# EAGLE design h_bridge (EAGLE 6.1)
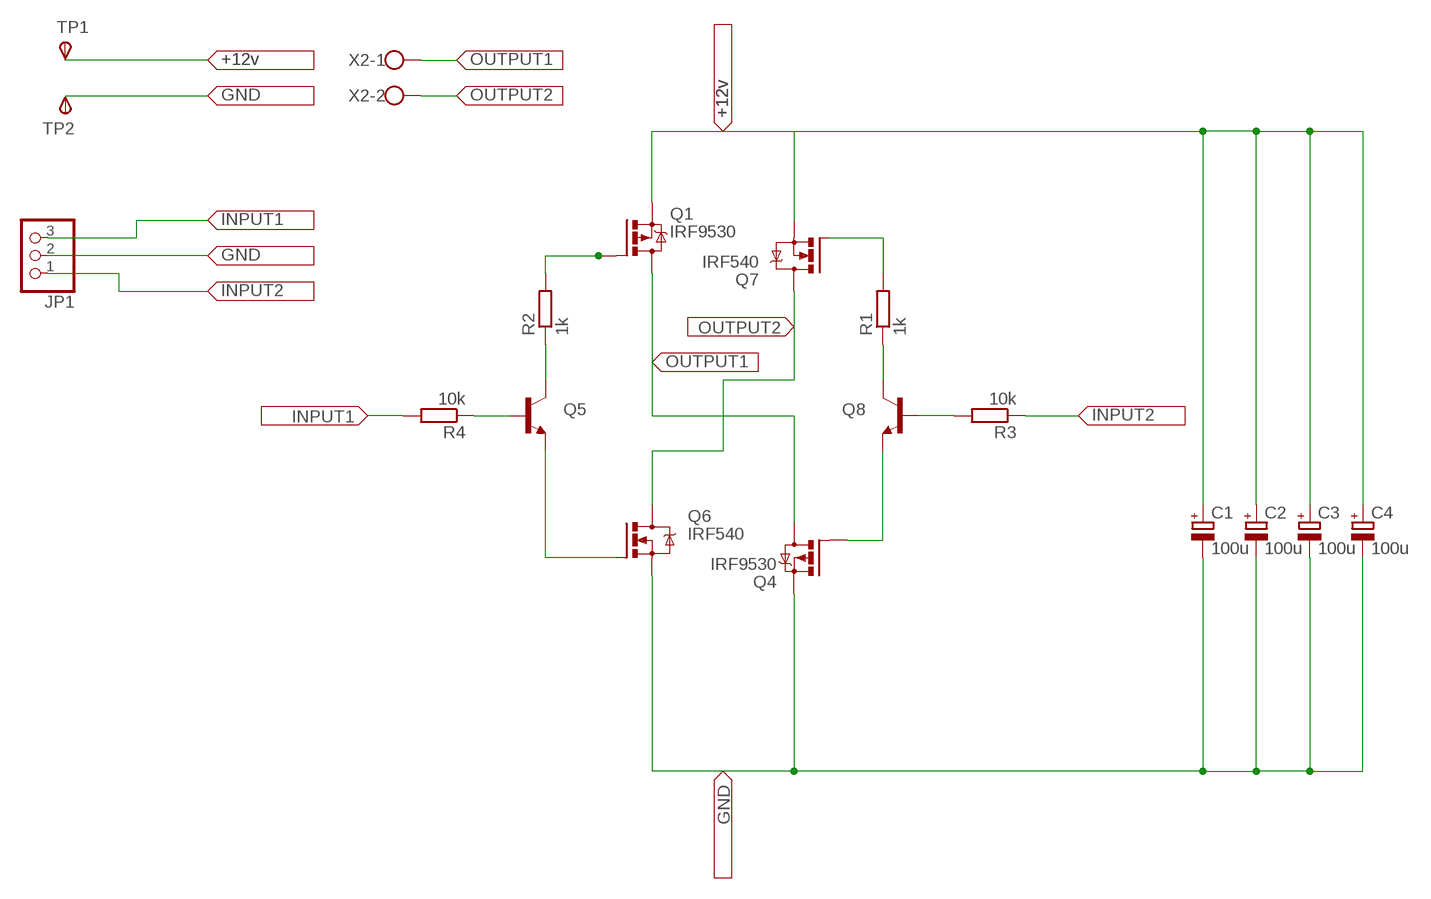
[diagram p0: schematic, sheet 1]

## Parts
C1  100u  CPOL-EUE2,5-6E  [E2,5-6E]
C2  100u  CPOL-EUE2,5-6E  [E2,5-6E]
C3  100u  CPOL-EUE2,5-6E  [E2,5-6E]
C4  100u  CPOL-EUE2,5-6E  [E2,5-6E]
JP1  PINHD-1X3  [1X03]
Q1  IRF9530  [TO220BV]
Q4  IRF9530  [TO220BV]
Q5  TRANSISTOR_NPNTO92  [TO-92]
Q6  IRF540  [TO220BV]
Q7  IRF540  [TO220BV]
Q8  TRANSISTOR_NPNTO92  [TO-92]
R1  1k  R-EU_0207/7  [0207/7]
R2  1k  R-EU_0207/7  [0207/7]
R3  10k  R-EU_0207/7  [0207/7]
R4  10k  R-EU_0207/7  [0207/7]
TP1  TPSPAD1-17Y  [P1-17Y]
TP2  TPSPAD1-17Y  [P1-17Y]
X2  W237-02P  [W237-132]

## Nets
+12V: C1.+ C2.+ C3.+ C4.+ Q1.S Q7.S TP1.TP(PP)
GND: C1.- C2.- C3.- C4.- JP1.2 Q4.S Q6.S TP2.TP(PP)
INPUT1: JP1.3 R4.2
INPUT2: JP1.1 R3.1
N$1: Q5.3(C) R2.1
N$2: Q1.G R2.2
N$3: R1.2
N$4: Q8.3(C) R1.1
N$5: Q5.1(E)
N$6: Q4.G Q8.1(E)
N$7: Q5.2(B) R4.1
N$8: Q8.2(B) R3.2
OUTPUT1: Q1.D Q4.D X2.1
OUTPUT2: Q6.D Q7.D X2.2
Unconnected: Q6.G Q7.G

## Library data of the parts
C1-C4 = resistor:CPOL-EU: POLARIZED CAPACITOR, European symbol
JP1 = pinhead:PINHD-1X3: PIN HEADER
Q1 Q4 = transistor-power:IRF9530: P-CHANNEL HEXFET POWER-MOS-FET Source: http://www.irf.com/product-info/datasheets/data/irf9530.pdf
Q5 Q8 = SparkFun:TRANSISTOR_NPN: Transistor NPN BJT configuration in SOT23 package. MMBT2222 is the common NPN we use. Double check BCE configuration again layout.
Q6 Q7 = transistor-power:IRF540: HEXFET Power MOSFET
R1-R4 = resistor:R-EU_: RESISTOR, European symbol
TP1 TP2 = testpad:TPS: TEST PIN
X2 = con-wago-508:W237-02P: WAGO SREW CLAMP

## Board
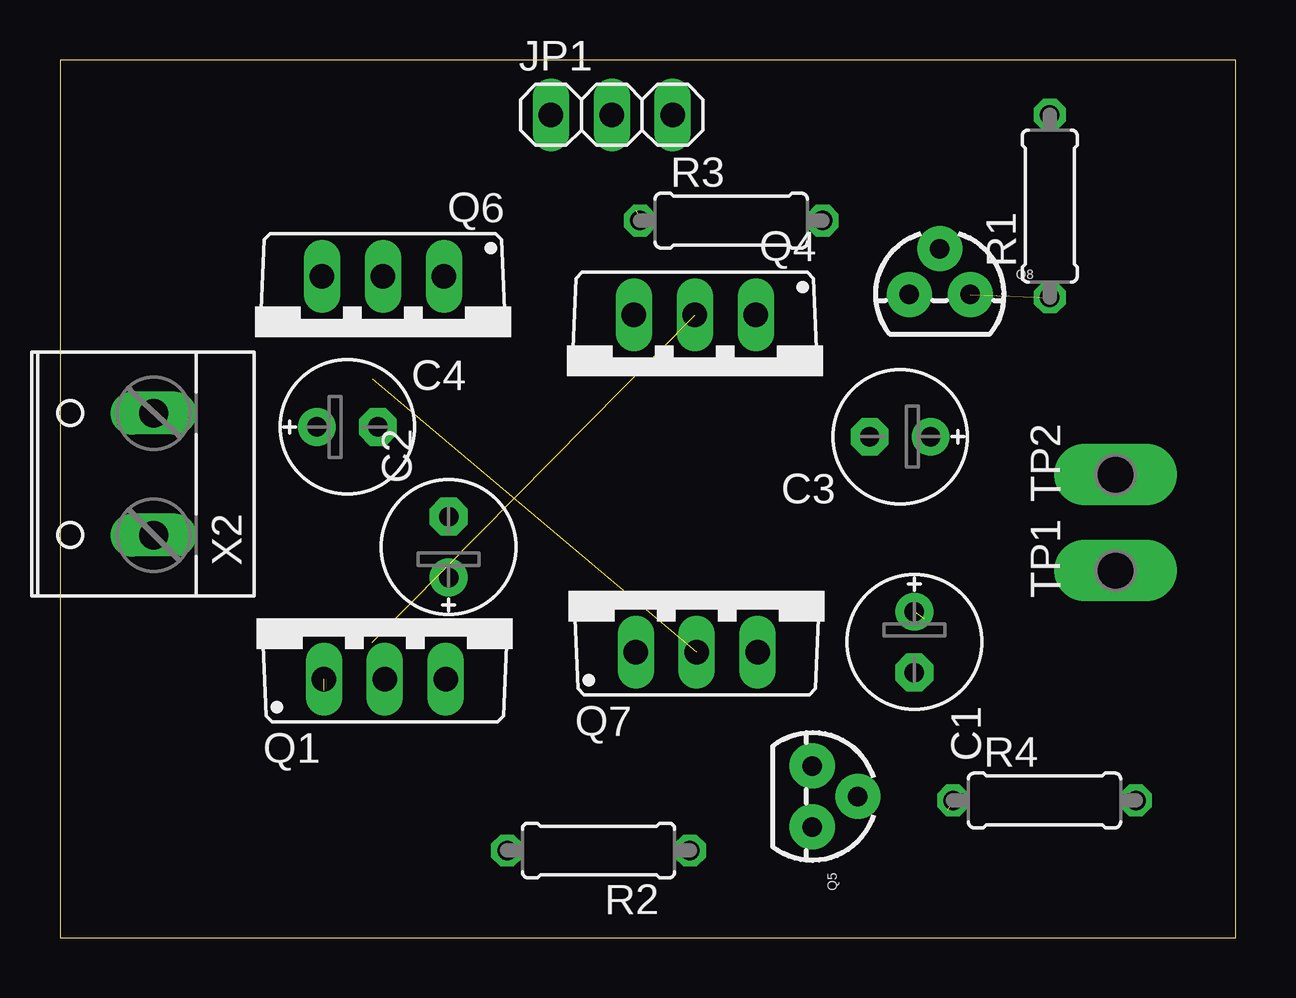
[diagram p1: board, top side]
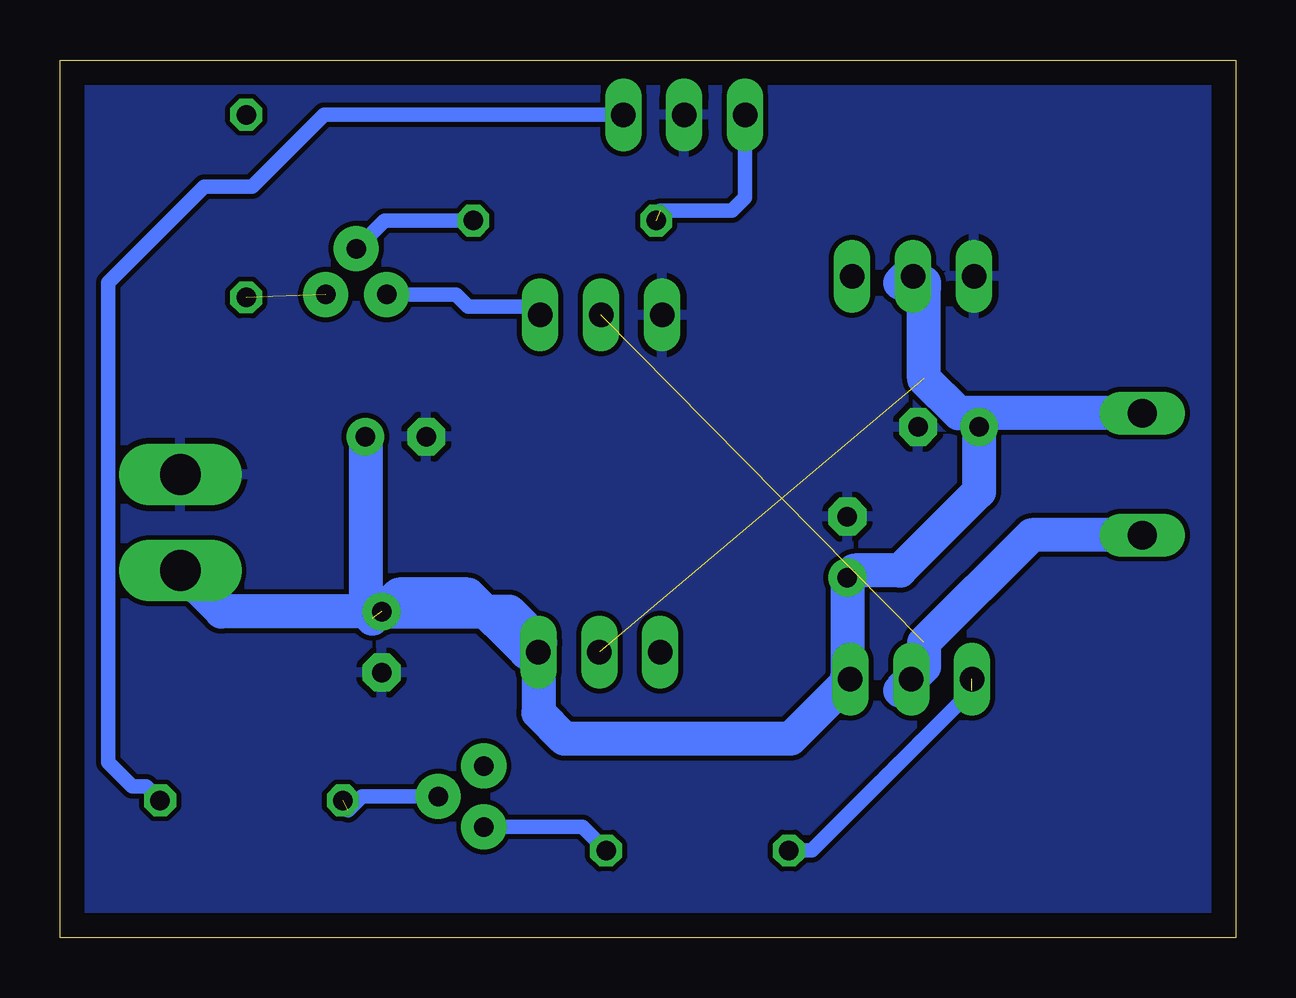
[diagram p2: board, bottom side, seen from below]

Size 49.02 x 36.58 mm. Coordinates in mm from the lower left corner, seen from the top.
Outline: 0,0 49.02,0 49.02,36.58 0,36.58 0,0
Copper layers (1*16): Top 0.035mm / dielectric 1.5mm / Bottom 0.035mm
Design rules: minimum track width 10mil, minimum drill 24mil, track to track 8mil, track to pad 8mil, pad to pad 8mil, via to via 8mil, smd to smd 8mil, copper to edge 40mil, drill to drill 8mil, minimum pad ring 10mil, minimum via ring 8mil, stop-mask expansion 4mil, vias tented up to drill 0mil, thermal gap 10mil

### Footprints (pad centres in the part's own frame; a part is rotated, then mirrored left to right if it is on the bottom)
E2,5-6E = drill 0.813 pad 1.575: + -1.27,0 | drill 0.813 pad 1.575 octagon: - 1.27,0
1X03 = drill 1.016 long: 1 -2.54,0; 2 0,0; 3 2.54,0
TO220BV = drill 1.016 long: D 0,-2.54; G -2.54,-2.54; S 2.54,-2.54
TO-92 = drill 0.813 pad 1.88: 1 -1.27,0; 2 0,1.905; 3 1.27,0
0207/7 = drill 0.813 octagon: 1 -3.81,0; 2 3.81,0
P1-17Y = drill 1.702 pad 2.121 long: TP 0,0
W237-132 = drill 1.194 long: 1 -2.54,-0.635; 2 2.54,-0.635

### Placement (x,y rotation side)
C1  35.61,12.32 270 top
C2  16.2,16.28 90 top
C3  35.02,20.88 180 top
C4  11.98,21.29 0 top
JP1  23,34.3 0 top
Q1  13.54,13.31 0 top
Q4  26.46,23.41 180 top
Q5  31.35,5.88 270 top
Q6  13.46,25.03 180 top
Q7  26.54,14.44 0 top
Q8  36.67,26.81 0 top
R1  41.26,30.49 90 top
R2  22.45,3.63 180 top
R3  27.98,29.89 0 top
R4  41.04,5.72 0 top
TP1  44,15.3 90 top
TP2  44,19.3 90 top
X2  3.27,19.32 90 top

### Tracks (layer width: path | path; a pad name or v marks a point on that pad's centre or on a via)
+12V  (1 unrouted)
  Bottom 0.61: 16.2,10.5 16,10.3
  Bottom 1.422: C1.+ 42.29,13.59 TP1.TP | C3.+ 36.29,13.59 36,13.3 | C4.+ 10.71,18.59 14,15.3 15.91,15.3 C2.+ 16.2,10.89 Q1.S | C1.+ 34.9,14.3 32,14.3 29.6,11.9 Q7.S 29.08,9.38 28,8.3 18.55,8.3 Q1.S | C1.+ 30.29,13.59 29,12.3 | 16.2,10.5 16.2,10.65 Q1.S
GND
  pour Bottom: 1,36.3 48,36.3 48,35.3 48,0.3 1,0.3 1,2.3
INPUT1
  Bottom 0.61: JP1.3 38,34.3 41,31.3 43,31.3 47,27.3 47,7.3 46,6.3 45.43,6.3 R4.2
INPUT2  (1 unrouted)
  Bottom 0.61: JP1.1 20.46,30.84 21,30.3 24,30.3
N$1
  Bottom 0.61: Q5.3 27.24,4.61 R2.1
N$2  (1 unrouted)
  Bottom 0.61: R2.2 17.67,3.63 11,10.3
N$4  (1 unrouted)
N$6
  Bottom 0.61: Q8.1 32.51,26.81 32,26.3 29.35,26.3 Q4.G
N$7  (1 unrouted)
  Bottom 0.61: Q5.2 36.42,5.88 37,5.3
N$8
  Bottom 0.61: R3.2 35.49,29.89 Q8.2
OUTPUT1  (1 unrouted)
  Bottom 1.422: X2.1 8.52,16.78 13,12.3 13,11.31 Q1.D | Q1.D 14,10.3 | Q1.D 13,11.3
OUTPUT2  (1 unrouted)
  Bottom 1.422: X2.2 11.56,21.86 13,23.3 13,27.11 Q6.D 13.73,27.57 14,27.3 13,27.3